# Altium schematic sheet 51-2001-01-7_04 Power Module Schematic.SchDoc
size 431 x 279 mm; Organization: ORGANIZATION; Address1: ADDRESS 1; Address2: ADDRESS 2; Address3: ADDRESS 3; Address4: ADDRESS 4; Revision: -; SheetNumber: 4; SheetTotal: 4; ENG_APP_DATE: --/--/--; DSN_APP_DATE: --/--/--; CHK_APP_DATE: --/--/--
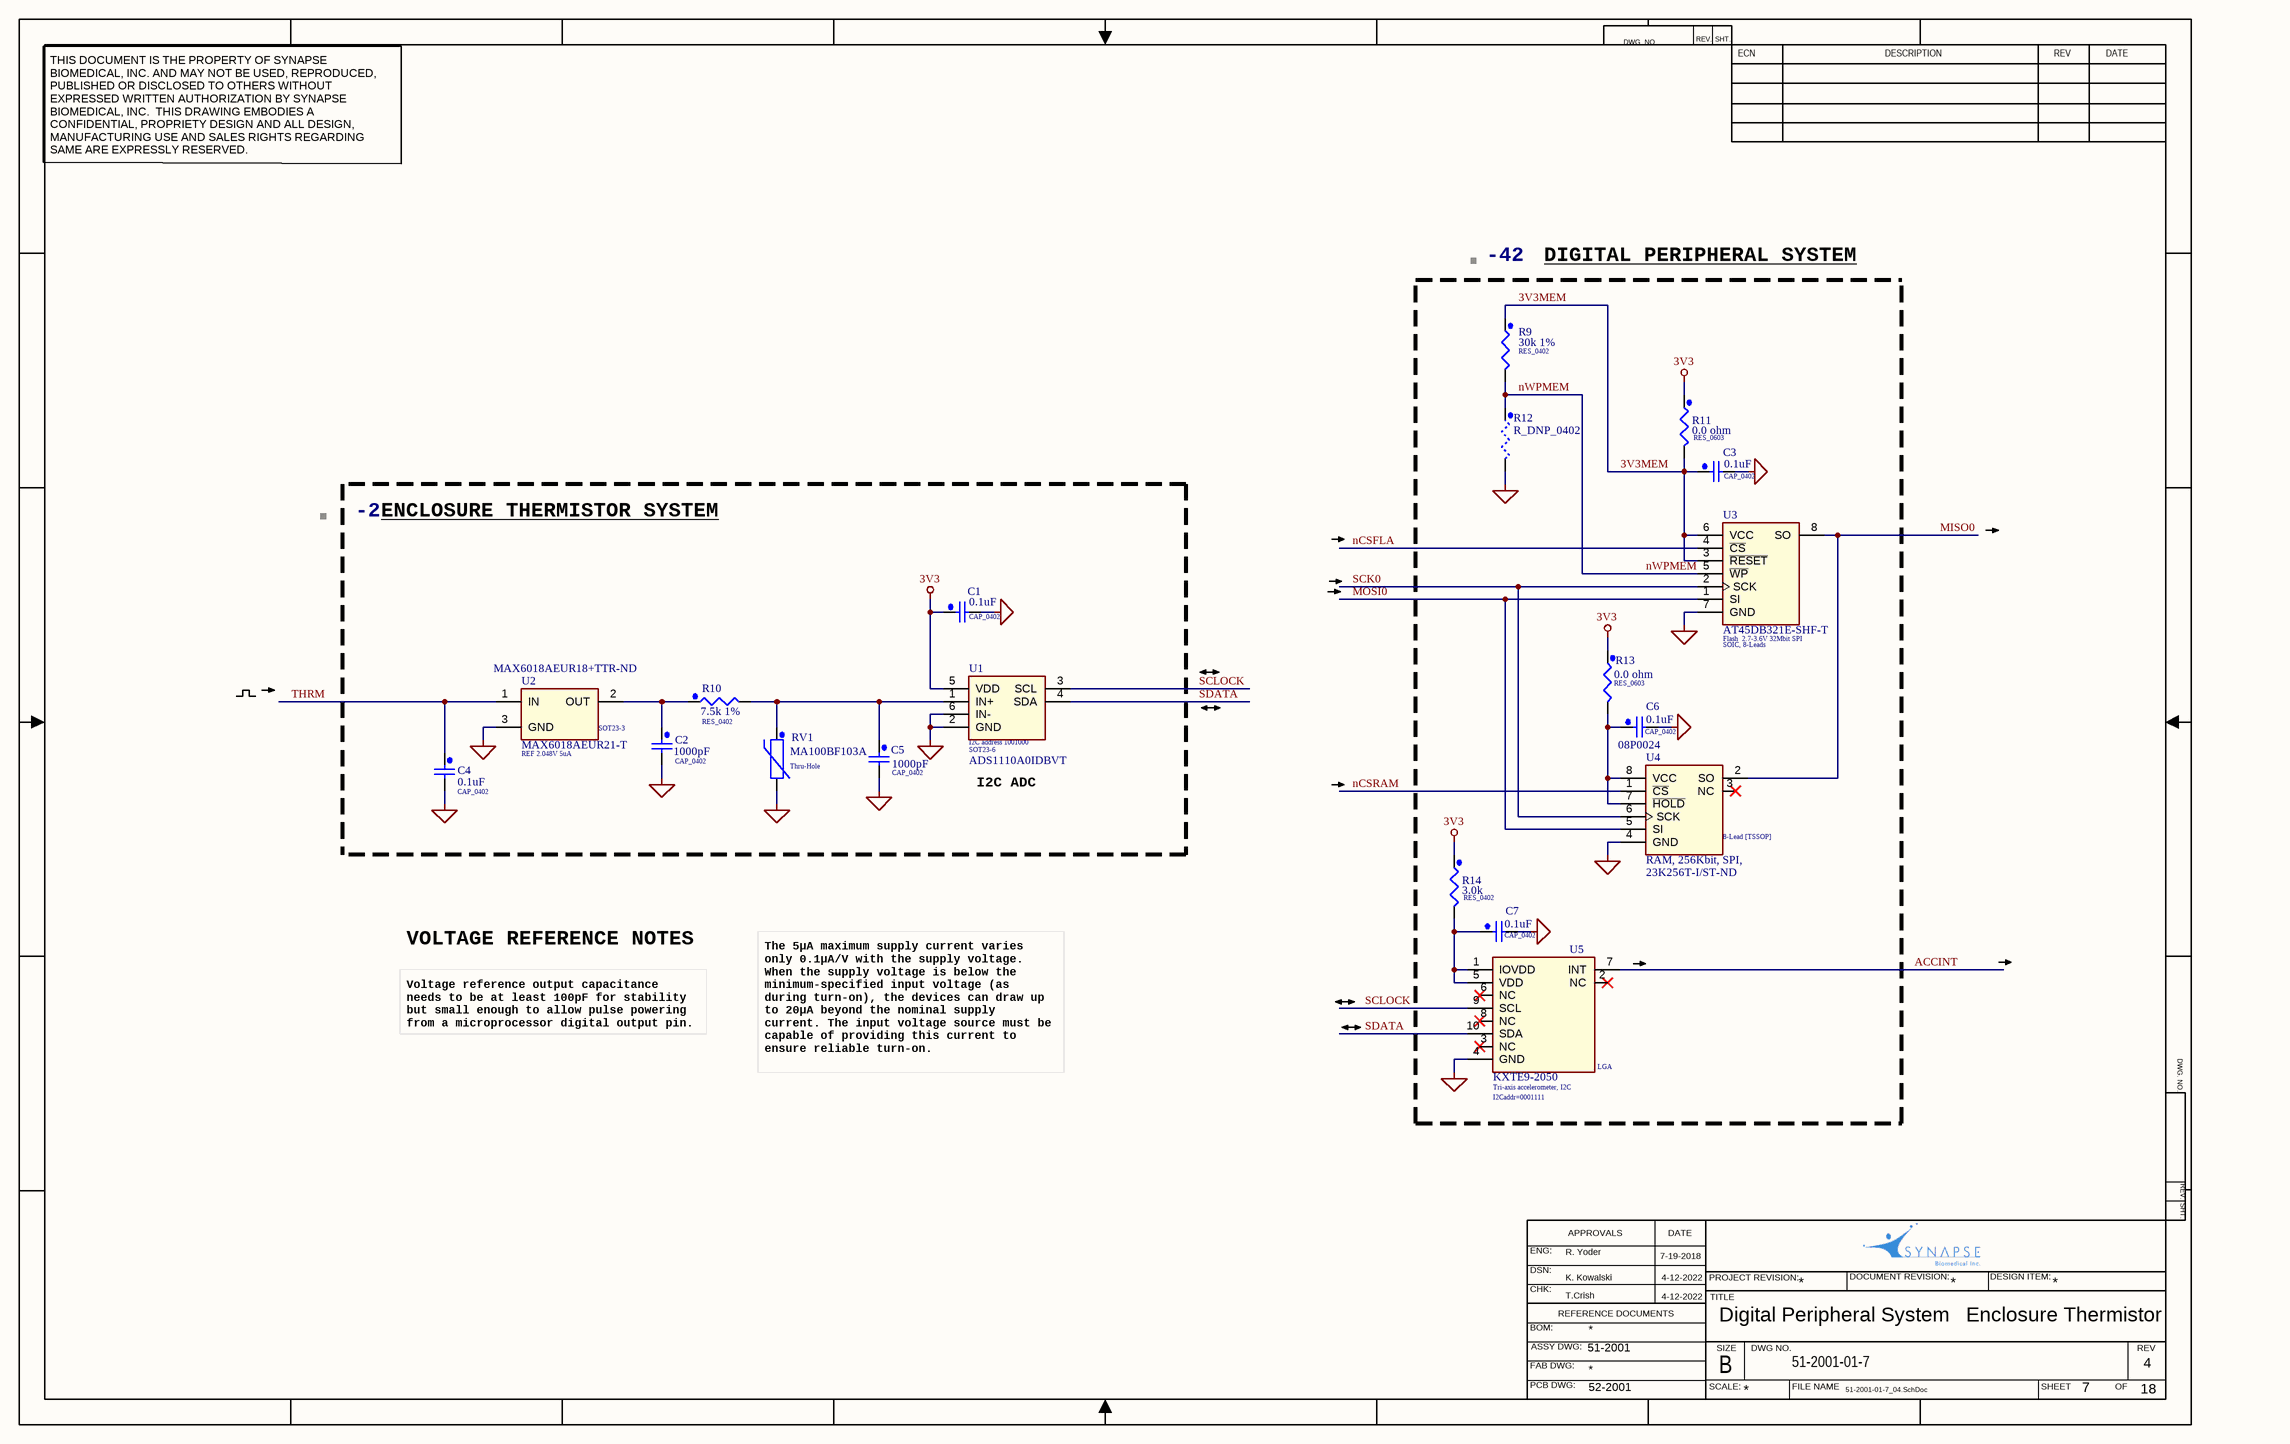
[diagram p0: 51-2001-01-7_04 Power Module Schematic.SchDoc]

## Parts
-2  XDESCRIPTION: ENCLOSURE THERMISTOR SYSTEM  (hidden comment: BOM_S1)  (graphical)
-42  XDESCRIPTION: DIGITAL PERIPHERAL SYSTEM  (hidden comment: BOM_S1)  (graphical)
C1  value 0.1uF  [CAP_0402]  (hidden comment: C_100n_X7R_16_0402_10%)
C2  value 1000pF  [CAP_0402]  (hidden comment: C_1n_C0G_50_0402_5%)
C3  value 0.1uF  [CAP_0402]  (hidden comment: C_100n_X7R_16_0402_10%)
C4  value 0.1uF  [CAP_0402]  (hidden comment: C_100n_X7R_16_0402_10%)
C5  value 1000pF  [CAP_0402]  (hidden comment: C_1n_C0G_50_0402_5%)
C6  value 0.1uF  [CAP_0402]  (hidden comment: C_100n_X7R_16_0402_10%)
C7  value 0.1uF  [CAP_0402]  (hidden comment: C_100n_X7R_16_0402_10%)
R9  value 30k 1%  [RES_0402]  (hidden comment: R_30k_0402)
R10  value 7.5k 1%  [RES_0402]  (hidden comment: 7.5k ohm, 1%, 1/16W, 0402, RoHS)
R11  value 0.0 ohm  [RES_0603]  (hidden comment: R_0_0603)
R12  R_DNP_0402  [RES_0402]  (no BOM)
R13  value 0.0 ohm  [RES_0603]  (hidden comment: R_0_0603)
R14  value 3.0k  PackageDescription: RES_0402  [RES_0603]  (hidden comment: R_0_0603)
RV1  PackageDescription: Thru-Hole  MPN: MA100BF103A  [NTC]  (hidden comment: Thermistor 10k radial NTC)
U1  Note: I2C address 1001000  MPN: ADS1110A0IDBVT  [SOT23-6]  (hidden comment: ADC 16bit I2C)
U2  REF 2.048V 5uA  Supplier Part Number 2: MAX6018AEUR18+TTR-ND  [SOT23-3]
U3  Flash  2.7-3.6V 32Mbit SPI  PackageDescription: SOIC, 8-Leads  MPN: AT45DB321E-SHF-T  [DFN8]
U4  RAM, 256Kbit, SPI,  PackageDescription: 8-Lead [TSSOP]  MPN: 23K256T-I/ST-ND  Supplier Part Number 2: 08P0024  [TSSOP-8L]
U5  Tri-axis accelerometer, I2C  PackageDescription: LGA  Note: I2Caddr=0001111  [lga10]

## Blocks framed on the sheet
I2C ADC: C1 C2 C4 C5 R10 RV1 U1 U2

## Nets
3V3: C1.1 R11.1 R13.1 R14.1 U1.5(VDD)
GND: C1.2 C2.2 C3.2 C4.2 C5.2 C6.2 C7.2 R12.2 RV1.2 U1.2(GND) U1.6(IN-) U2.3(GND) U3.7(GND) U4.4(GND) U5.4(GND)
3V3MEM: C3.1 R9.1 R11.2 U3.3(~{RESET}) U3.6(VCC)
ACCINT: U5.7(INT)
MISO0: U3.8(SO) U4.2(SO)
MOSI0: U3.1(SI) U4.5(SI)
nCSFLA: U3.4(~{CS})
nCSRAM: U4.1(~{CS})
nWPMEM: R9.2 R12.1 U3.5(~{WP})
SCK0: U3.2(SCK) U4.6(SCK)
SCLOCK: U1.3(SCL) U5.9(SCL)
SDATA: U1.4(SDA) U5.10(SDA)
THRM: C4.1 U2.1(IN)
NetC2_1: C2.1 R10.1 U2.2(OUT)
NetC5_1: C5.1 R10.2 RV1.1 U1.1(IN+)
NetC6_1: C6.1 R13.2 U4.7(~{HOLD}) U4.8(VCC)
NetC7_1: C7.1 R14.2 U5.1(IOVDD) U5.5(VDD)

Not connected (* = marked no-connect by the designer): U4 3(NC)*; U5 2(NC)* 3(NC)* 6(NC)* 8(NC)*

## Notes on the sheet
- DWG. NO.
- REV.
- SHT.
- ECN
- DESCRIPTION
- REV
- DATE
- THIS DOCUMENT IS THE PROPERTY OF SYNAPSE BIOMEDICAL, INC. AND MAY NOT BE USED, REPRODUCED, PUBLISHED OR DISCLOSED TO OTHERS WITHOUT EXPRESSED WRITTEN AUTHORIZATION BY SYNAPSE BIOMEDICAL, INC.  THIS DRAWING EMBODIES A CONFIDENTIAL, PROPRIETY DESIGN AND ALL DESIGN, MANUFACTURING USE AND SALES RIGHTS REGARDING SAME ARE EXPRESSLY RESERVED.
- VOLTAGE REFERENCE NOTES
- Voltage reference output capacitance needs to be at least 100pF for stability but small enough to allow pulse powering from a microprocessor digital output pin.
- The 5μA maximum supply current varies only 0.1μA/V with the supply voltage. When the supply voltage is below the minimum-specified input voltage (as during turn-on), the devices can draw up to 20μA beyond the nominal supply current. The input voltage source must be capable of providing this current to ensure reliable turn-on.
- ENG:
- R. Yoder
- APPROVALS
- 7-19-2018
- DSN:
- CHK:
- REFERENCE DOCUMENTS
- K. Kowalski
- T.Crish
- 4-12-2022
- PROJECT REVISION:
- TITLE
- Digital Peripheral System   Enclosure Thermistor
- *
- DOCUMENT REVISION:
- DESIGN ITEM:
- BOM:
- FAB DWG:
- PCB DWG:
- ASSY DWG:
- 51-2001
- SCALE:
- SIZE
- B
- DWG NO.
- 51-2001-01-7
- FILE NAME
- SHEET
- OF
- 4
- 52-2001
- 51-2001-01-7_04.SchDoc
- 7
- 18

## Library data of the parts
-2 -42 = BOM_S1: BOM item small graphic
C1 C3 C4 C6 C7 = GRM155R71C104KA88D: 0.1uF, 16V, X7R, 0402, RoHS; MFR: Murata; SBI: 53-0040-1; PackageDescription: CAP_0402; Supplier 1: Digi-Key; Supplier Part Number 1: 490-3261-2-ND; MPN: GRM155R71C104KA88D
C2 C5 = GRM1555C1H102JA01D: 1000pF, 50V, C0G, 5%, 0402, RoHS; MFR: Murata; SBI: 53-0041-2; ClassName: THMREF; PackageDescription: CAP_0402; Supplier 1: Digi-Key; Supplier Part Number 1: 490-3244-1-ND; MPN: GRM1555C1H102JA01D
R9 = MCR01MZPF3002: 30k ohm, 1%, 1/16W, 0402, RoHS; MFR: Vishay Dale; MPN: CRCW040230K0FKED; SBI: 53-0049-21; PackageDescription: RES_0402; Supplier 1: Digi-Key; Supplier Part Number 1: 541-30.0KLDKR-ND
R10 = TNPW04027K50BEED: MFR: Vishay Dale; SBI: 53-0049-22; PackageDescription: RES_0402; Supplier 1: Digi-Key; Supplier Part Number 1: TNP7.50KDADKR-ND; MPN: TNPW04027K50BEED
R11 R13 = MCR03ERTJ000: 0.0 ohm, 1/16W, 0603, RoHS; MFR: Vishay Dale; MPN: CRCW06030000Z0EA; SBI: 53-0075; PackageDescription: RES_0603; Supplier 1: Digi-Key; Supplier Part Number 1: 541-1.00KLDKR-ND
R12 = R_DNP_0402: DO NOT POPULATE; MFR: DO NOT POPULATE; MPN: DO NOT POPULATE; PackageDescription: CAP_0402
R14 = MCR03ERTJ000: 3.0k ohm, 1/16W, 0603, RoHS; MFR: Vishay Dale; MPN: CRCW04023K00FKEDHP; Supplier 1: Digi-Key; Supplier Part Number 1: 541-CRCW04023K00FKEDHPCT-ND
RV1 = RT_10k_rad: Thermistor, 10k, radial, NTC, RoHS; MFR: Amphenol Advanced Sensors; SBI: 53-0091; Supplier 1: MOUSER; Supplier Part Number 1: 527-MA100BF103A; Value: 10k
U1 = ADS1110A0IDBV: ADC, 16bit, I2C, SOT23-6, RoHS; MFR: Texas Instruments; SBI: 54-0086; Supplier 1: Digi-Key; Supplier Part Number 1: 296-14461-1-ND; PackageDescription: SOT23-6; Value: *
U2 = MAX6018AEUR21-T: Ref, 2.048V, 5uA, SOT23-3, RoHS; MFR: Maxim Integrated; SBI: 54-0087; PackageDescription: SOT23-3; ClassName: THMREF; Supplier 1: Digi-Key; Supplier Part Number 1: MAX6018AEUR21+TDKR-ND; MPN: MAX6018AEUR21-T; Supplier 2: Digi-Key; Design item id: *
U3 = AT45DB321D-SU: Flash, 32Mbit, SPI, SO8; MFR: Adesto Technologies; SBI: 54-0088; Supplier 1: Digi-Key; Supplier Part Number 1: 1265-1097-6-ND; Value: 32Mbit
U4 = 23K256T-I/ST: RAM, 256Kbit, SPI, TSSOP8, RoHS; MFR: MicroChip Technology; Supplier 1: Digi-Key; Supplier Part Number 1: 23K256T-I/STDKR-ND; ComponentLink1URL: http://ww1.microchip.com/downloads/en/DeviceDoc/22100D.pdf; Value: 256Kbit; Supplier 2: Newark
U5 = KXTE9-2050: Tri-axis accelerometer, I2C,  LGA10, RoHS; MFR: Kionix; SBI: 54-0074; Supplier 1: MOUSER; Supplier Part Number 1: 912-KXTE9-2050; MPN: KXTE9-2050